# EAGLE design Renesas_Raspi1_Add_On_V2 (EAGLE 9.1.3)
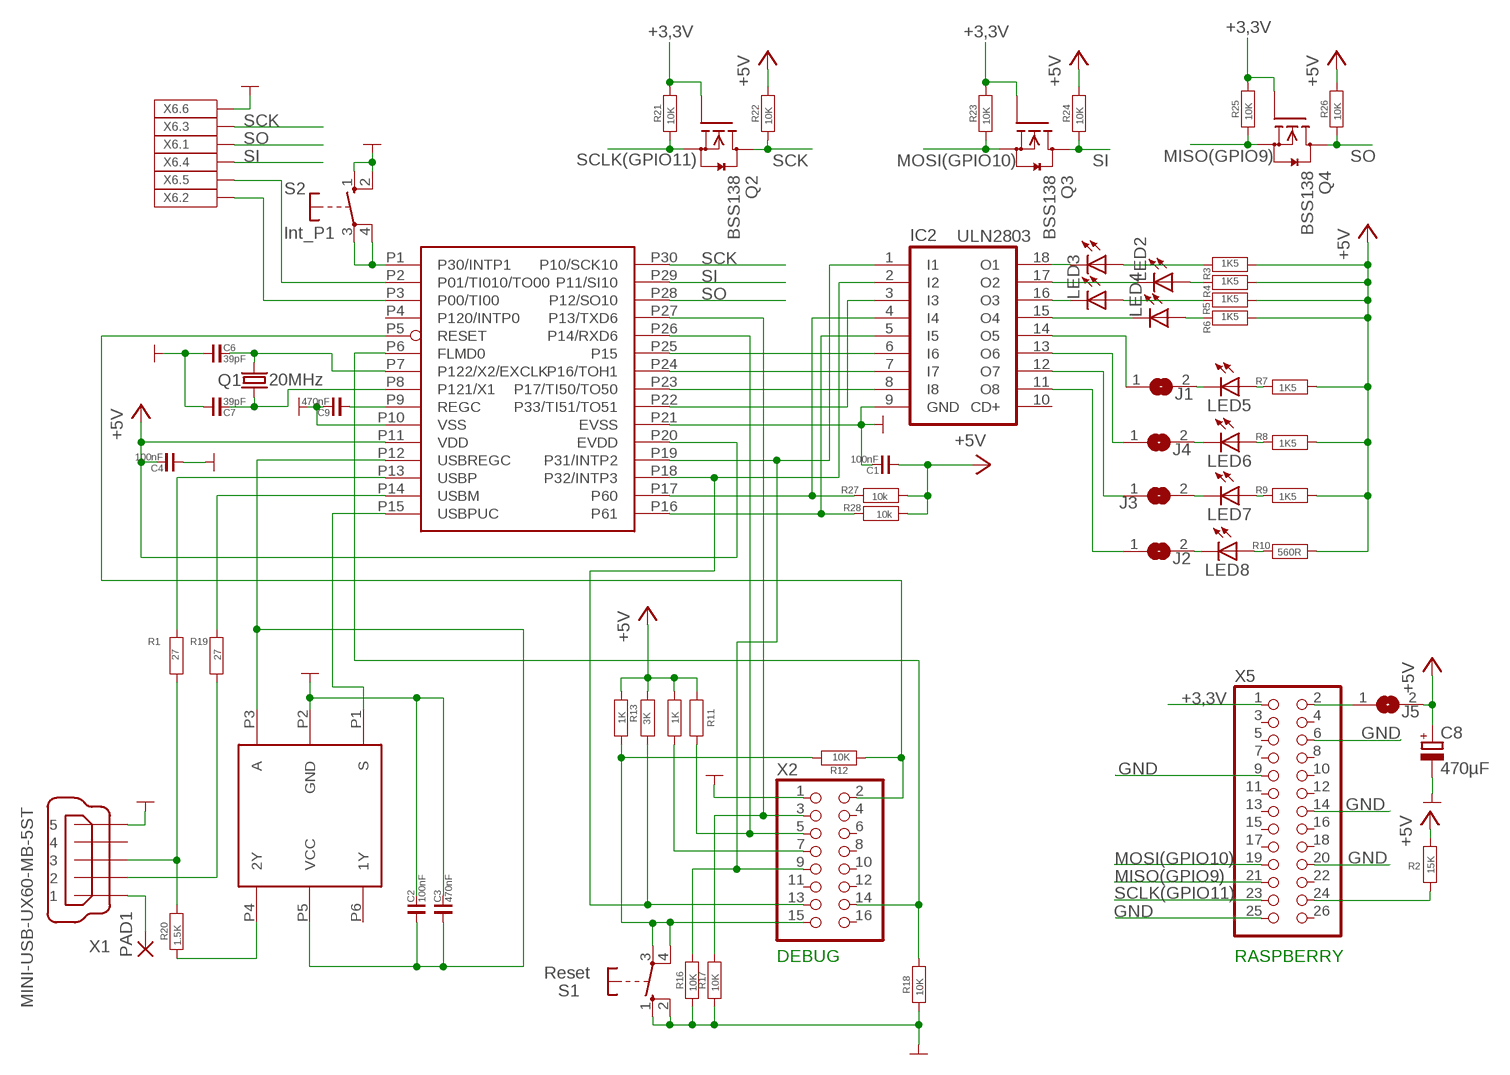
[diagram p0: schematic, sheet 1]

## Parts
C1  100nF  C-0603  [0603]
C2  100nF  C-0603  [0603]
C3  470nF  C-0603  [0603]
C4  100nF  C-0603  [0603]
C6  39pF  C-0603  [0603]
C7  39pF  C-0603  [0603]
C8  470µF  CPOL-EUSANYO_SMD_F8  [SANYO-OSCON_SMD_F8]
C9  470nF  C-0603  [0603]
IC1  78F0730_CAB_AX  [SSOP30]
IC2  ULN2803  [SOJ18-4]
IC3  74LVC1G18  [74LVC1G18]
J1  SJ  [SJ]
J2  SJ  [SJ]
J3  SJ  [SJ]
J4  SJ  [SJ]
J5  SJ  [SJ]
LED1  LEDCHIP-LED0603  [CHIP-LED0603]
LED2  LEDCHIP-LED0603  [CHIP-LED0603]
LED3  LEDCHIP-LED0603  [CHIP-LED0603]
LED4  LEDCHIP-LED0603  [CHIP-LED0603]
LED5  LEDCHIP-LED0603  [CHIP-LED0603]
LED6  LEDCHIP-LED0603  [CHIP-LED0603]
LED7  LEDCHIP-LED0603  [CHIP-LED0603]
LED8  LEDCHIP-LED0603  [CHIP-LED0603]
PAD1  1,6/0,8  [1,6/0,8]
Q1  20MHz  CRYSTALHC49UP  [HC49UP]
Q2  BSS138  [SOT23]
Q3  BSS138  [SOT23]
Q4  BSS138  [SOT23]
R1  27  R-0603  [0603]
R2  15K  R-0603  [0603]
R3  1K5  R-0603  [0603]
R4  1K5  R-0603  [0603]
R5  1K5  R-0603  [0603]
R6  1K5  R-0603  [0603]
R7  1K5  R-0603  [0603]
R8  1K5  R-0603  [0603]
R9  1K5  R-0603  [0603]
R10  560R  R-0603  [0603]
R11  3K  R-0603  [0603]
R12  10K  R-0603  [0603]
R13  3K  R-0603  [0603]
R14  1K  R-0603  [0603]
R15  1K  R-0603  [0603]
R16  10K  R-0603  [0603]
R17  10K  R-0603  [0603]
R18  10K  R-0603  [0603]
R19  27  R-0603  [0603]
R20  1.5K  R-0603  [0603]
R21  10K  R-0603  [0603]
R22  10K  R-0603  [0603]
R23  10K  R-0603  [0603]
R24  10K  R-0603  [0603]
R25  10K  R-0603  [0603]
R26  10K  R-0603  [0603]
R27  10k  R-0603  [0603]
R28  10k  R-0603  [0603]
S1  Reset  DT6  [DT6]
S2  Int_P1  DT6  [DT6]
X1  MINI-USB-UX60-MB-5ST  [UX60-MB-5ST]
X2  PINHD-2X8  [2X08]
X5  PINHD-2X13  [2X13]
X6  2X3  [2X3]

## Nets
+3,3V: Q2.1(G) Q3.1(G) Q4.1(G) R21.1 R23.1 R25.1 X5.1
+5V: C1.1 C4.2 C8.+ IC1.P11(VDD) IC1.P20(EVDD) J5.2 R2.1 R3.2 R4.2 R5.2 R6.2 R7.1 R8.1 R9.1 R10.1 R11.1 R13.2 R14.1 R15.1 R22.1 R24.1 R26.1 R27.1 R28.1
GND: C1.2 C2.2 C3.2 C4.1 C6.1 C7.1 C8.- C9.2 IC1.P10(VSS) IC1.P21(EVSS) IC2.9(GND) IC3.P2(GND) R16.2 R17.2 R18.2 S1.1(S) S1.2(S) S2.1(S) S2.2(S) X1.5 X2.1 X5.6 X5.9 X5.14 X5.20 X5.25 X6.6
MISO(GPIO9): Q4.2(S) R25.2 X5.21
MOSI(GPIO10): Q3.2(S) R23.2 X5.19
N$1: C7.2 IC1.P8(P121/X1) Q1.1
N$2: IC1.P5(RESET) R12.2 X2.2
N$3: IC2.18(O1) LED1.C
N$4: IC2.17(O2) LED2.C
N$5: C6.2 IC1.P7(P122/X2/EXCLK) Q1.2
N$6: IC2.16(O3) LED3.C
N$7: IC1.P22(P33/TI51/TO51) IC2.3(I3)
N$8: IC1.P17(P60) IC2.4(I4) R27.2
N$9: PAD1.1(P) X1.1
N$10: IC1.P19(P31/INTP2) IC2.1(I1) R16.1 X2.9
N$11: IC1.P16(P61) IC2.5(I5) R28.2
N$12: IC1.P25(P15) IC2.6(I6)
N$13: IC1.P24(P16/TOH1) IC2.7(I7)
N$14: R12.1 R15.2 S1.3(P) S1.4(P) X2.15
N$15: IC1.P23(P17/TI50/TO50) IC2.8(I8)
N$16: R2.2 X5.24
N$17: LED1.A R3.1
N$18: IC2.15(O4) LED4.C
N$20: J5.1 X5.2
N$21: R14.2 X2.7
N$23: LED2.A R4.1
N$24: LED3.A R5.1
N$25: IC1.P1(P30/INTP1) S2.3(P) S2.4(P)
N$26: LED4.A R6.1
N$27: LED8.A R10.2
N$30: IC1.P2(P01/TI010/TO00) X6.5
N$31: IC1.P3(P00/TI00) X6.2
N$33: IC2.13(O6) J4.1
N$35: C9.1 IC1.P9(REGC)
N$38: J1.2 LED5.C
N$39: IC2.12(O7) J3.1
N$40: LED7.A R9.2
N$41: IC2.11(O8) J2.1
N$42: LED6.A R8.2
N$43: LED5.A R7.2
N$44: IC1.P6(FLMD0) R18.1 X2.14
N$46: IC1.P18(P32/INTP3) IC2.2(I2) R13.1 X2.13
N$51: IC1.P13(USBP) R1.1
N$52: R1.2 R20.1 X1.3
N$56: R19.2 X1.2
N$57: IC1.P14(USBM) R19.1
N$58: IC1.P15(USBPUC) IC3.P1(S)
N$59: C2.1 C3.1 IC1.P12(USBREGC) IC3.P3(A) IC3.P5(VCC)
N$60: IC3.P4(2Y) R20.2
N$65: J4.2 LED6.C
N$66: J3.2 LED7.C
N$67: J2.2 LED8.C
N$68: IC2.14(O5) J1.1
N$110: IC1.P26(P14/RXD6) R11.2 X2.5
N$113: IC1.P27(P13/TXD6) R17.1 X2.3
SCK: IC1.P30(P10/SCK10) Q2.3(D) R22.2 X6.3
SCLK(GPIO11): Q2.2(S) R21.2 X5.23
SI: IC1.P29(P11/SI10) Q3.3(D) R24.2 X6.4
SO: IC1.P28(P12/SO10) Q4.3(D) R26.2 X6.1
Unconnected: IC1.P4(P120/INTP0) IC2.10(CD+) IC3.P6(1Y) X1.4 X2.4 X2.6 X2.8 X2.10 X2.11 X2.12 X2.16 X5.3 X5.4 X5.5 X5.7 X5.8 X5.10 X5.11 X5.12 X5.13 X5.15 X5.16 X5.17 X5.18 X5.22 X5.26

## Notes on the sheet
- DEBUG | RASPBERRY

## Library data of the parts
C1-C4 C6 C7 C9 = RLC:C-0603
C8 = rcl:CPOL-EU: POLARIZED CAPACITOR, European symbol
IC1 = Renesas_78k0_0_2:78F0730_CAB_AX
IC2 = smd-ipc:ULN2803
IC3 = Hand_Solder_Special:74LVC1G18
J1-J5 = jumper:SJ: SMD solder JUMPER
LED1-LED8 = led:LED: LED OSRAM: - CHIPLED LG R971, LG N971, LY N971, LG Q971, LY Q971, LO R971, LY R971 LH N974, LH R974 LS Q976, LO Q976, LY Q976 LO Q996 - Hyper CHIPLED LW Q18S LB Q993, LB Q99A, LB R99A - SideLED LS A670, LO A670, LY A670, LG A670, LP A670 LB A673, LV A673, LT A673, LW A673 LH A674 LY A675 LS A676, LA A676, LO A676, LY A676, LW A676 LS A679, LY A679, LG A679 - Hyper Micro SIDELED® LS Y876, LA Y876, LO Y876, LY Y876 LT Y87S - SmartLED LW L88C, LW L88S LB L89C, LB L89S, LG L890 LS L89K, LO L89K, LY L89K LS L896, LA L896, LO L896, LY L896 - TOPLED LS T670, LO T670, LY T670, LG T670, LP T670 LSG T670, LSP T670, LSY T670, LOP T670, LYG T670 LG T671, LOG T671, LSG T671 LB T673, LV T673, LT T673, LW T673 LH T674 LS T676, LA T676, LO T676, LY T676, LB T676, LH T676, LSB T676, LW T676 LB T67C, LV T67C, LT T67C, LS T67K, LO T67K, LY T67K, LW E67C LS E67B, LA E67B, LO E67B, LY E67B, LB E67C, LV E67C, LT E67C LW T67C LS T679, LY T679, LG T679 LS T770, LO T770, LY T770, LG T770, LP T770 LB T773, LV T773, LT T773, LW T773 LH T774 LS E675, LA E675, LY E675, LS T675 LS T776, LA T776, LO T776, LY T776, LB T776 LHGB T686 LT T68C, LB T68C - Hyper Mini TOPLED® LB M676 - Mini TOPLED Santana® LG M470 LS M47K, LO M47K, LY M47K Source: http://www.osram.convergy.de LUXEON: - LUMILED® LXK2-PW12-R00, LXK2-PW12-S00, LXK2-PW14-U00, LXK2-PW14-V00 LXK2-PM12-R00, LXK2-PM12-S00, LXK2-PM14-U00 LXK2-PE12-Q00, LXK2-PE12-R00, LXK2-PE12-S00, LXK2-PE14-T00, LXK2-PE14-U00 LXK2-PB12-K00, LXK2-PB12-L00, LXK2-PB12-M00, LXK2-PB14-N00, LXK2-PB14-P00, LXK2-PB14-Q00 LXK2-PR12-L00, LXK2-PR12-M00, LXK2-PR14-Q00, LXK2-PR14-R00 LXK2-PD12-Q00, LXK2-PD12-R00, LXK2-PD12-S00 LXK2-PH12-R00, LXK2-PH12-S00 LXK2-PL12-P00, LXK2-PL12-Q00, LXK2-PL12-R00 Source: www.luxeon.com KINGBRIGHT: KA-3528ASYC Source: www.kingbright.com
PAD1 = wirepad:1,6/0,8: THROUGH-HOLE PAD
Q1 = crystal:CRYSTAL: CRYSTAL
Q2-Q4 = m-pad-2.1:BSS138: Fairchild Semiconductors BSS138 N-Channel Logic Level Enhancement Mode Field Effect Transistor General Description: These N-Channel enhancement mode field effect transistors are produced using Fairchild's proprietary, high cell density, DMOS technology. These products have been designed to minimize on-state resistance while provide rugged, reliable, and fast switching performance.These products are particularly suited for low voltage, low current applications such as small servo motor control, power MOSFET gate drivers, and other switching applications. Features: 0.22 A, 50 V. RDS(ON) = 3.5Ohm @ VGS = 10 V RDS(ON) = 6.0Ohm @ VGS = 4.5 V High density cell design for extremely low RDS(ON) Rugged and Reliable Compact industry standard SOT-23 surface mount package Please send any comments to: messi@users.sourceforge.net
R1-R28 = RLC:R-0603
S1 S2 = switch-misc:DT: ITT SWITCH
X1 = con-hirose:MINI-USB-: MINI USB Connector Source: http://www.hirose.co.jp/cataloge_hp/e24000019.pdf; OC_FARNELL: unknown; OC_NEWARK: unknown
X2 = pinhead_2mm:PINHD-2X8: PIN HEADER
X5 = pinhead2:PINHD-2X13: PIN HEADER
X6 = Connecto:2X3

## Board
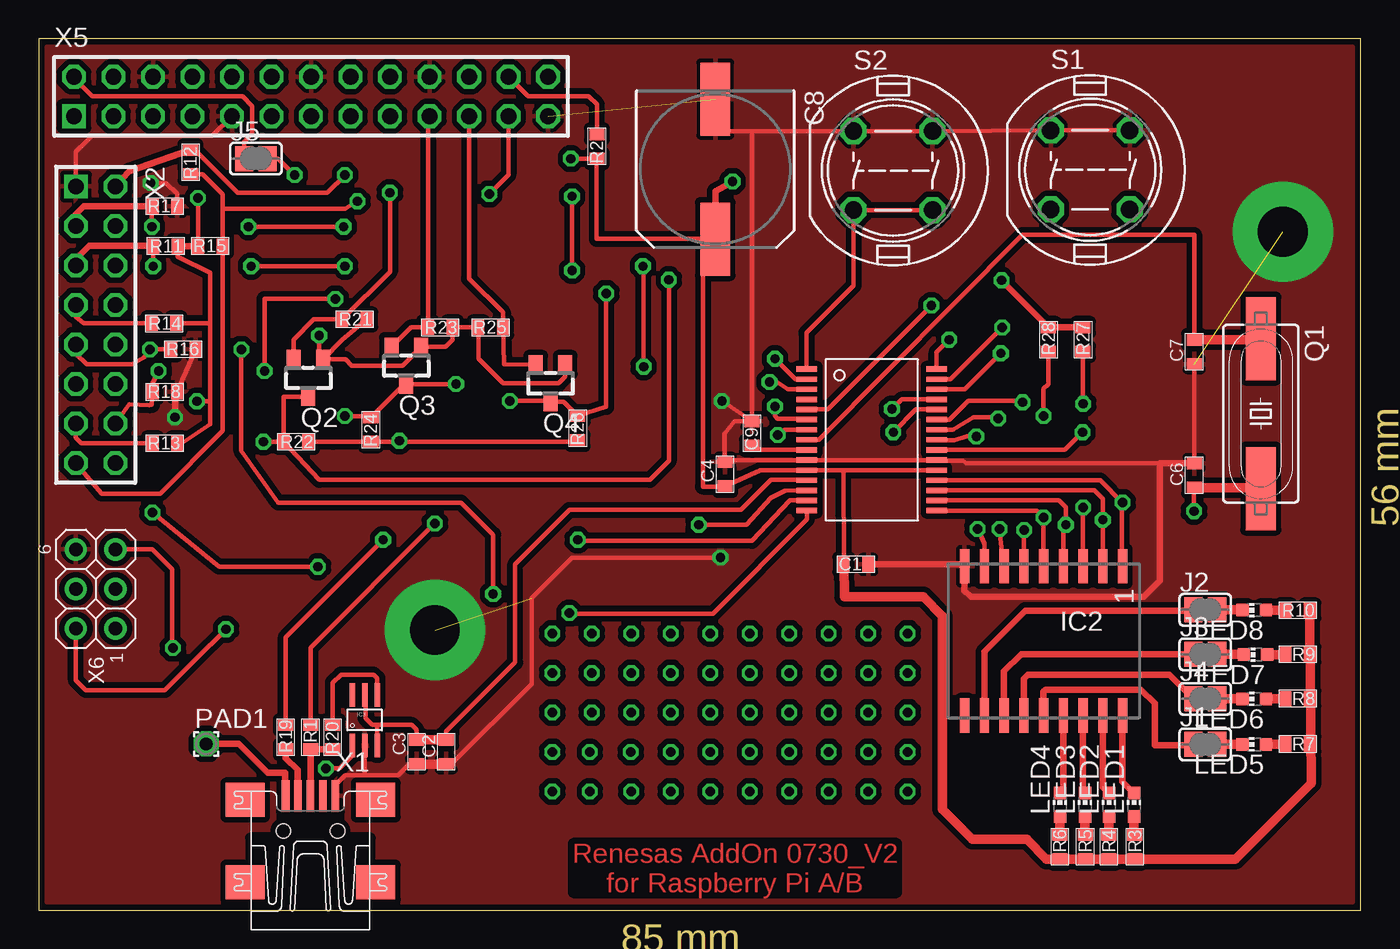
[diagram p1: board, top side]
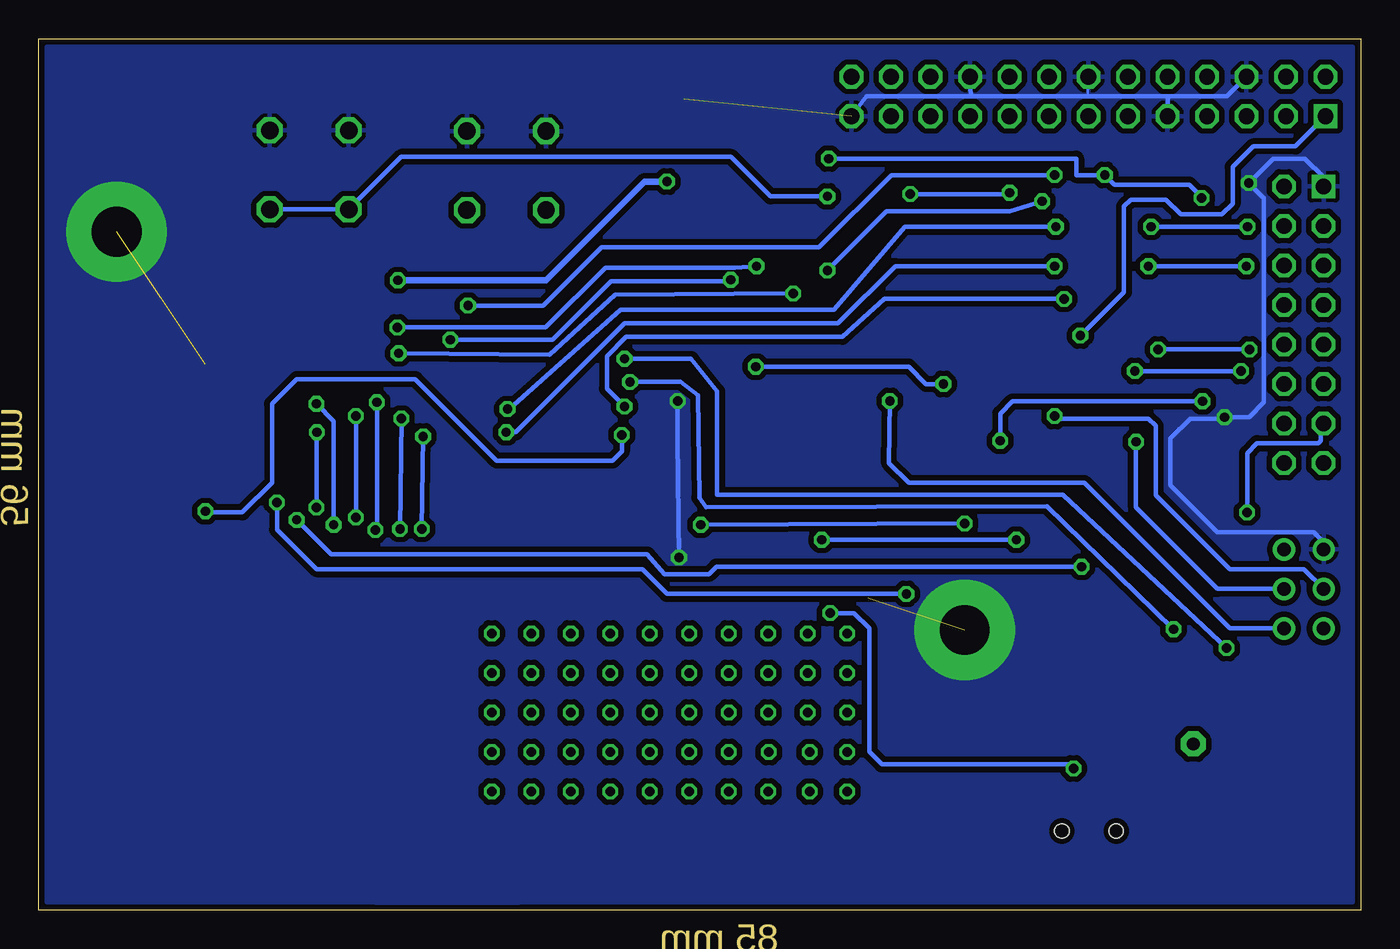
[diagram p2: board, bottom side, seen from below]

Size 85 x 56 mm. Coordinates in mm from the lower left corner, seen from the top.
Outline: 0,0 85,0 85,56 0,56 0,0
Copper layers (1*16): Top 0.035mm / dielectric 1.5mm / Bottom 0.035mm
Design rules "default": minimum track width 1mil, minimum drill 5mil, track to track 4mil, track to pad 4mil, pad to pad 4mil, via to via 4mil, smd to smd 4mil, copper to edge 0mil, drill to drill 1mil, minimum pad ring 10mil, minimum via ring 8mil, stop-mask expansion 4mil, vias tented up to drill 0mil, thermal gap 10mil

### Footprints (pad centres in the part's own frame; a part is rotated, then mirrored left to right if it is on the bottom)
0603 = smd 0.762 x 0.965: 1 -0.787,0; 2 0.787,0
SANYO-OSCON_SMD_F8 = smd 4.7 x 1.9: + 4.5,0; - -4.5,0
SSOP30 = smd 0.34 x 1.32: P1 -4.296,-4.423; P2 -3.646,-4.423; P3 -2.996,-4.423; P4 -2.346,-4.423; P5 -1.696,-4.423; P6 -1.046,-4.423; P7 -0.396,-4.423; P8 0.254,-4.423; P9 0.904,-4.423; P10 1.554,-4.423; P11 2.204,-4.423; P12 2.854,-4.423; P13 3.504,-4.423; P14 4.154,-4.423; P15 4.804,-4.423; P16 4.804,3.915; P17 4.154,3.915; P18 3.504,3.915; P19 2.854,3.915; P20 2.204,3.915; P21 1.554,3.915; P22 0.904,3.915; P23 0.254,3.915; P24 -0.396,3.915; P25 -1.046,3.915; P26 -1.696,3.915; P27 -2.346,3.915; P28 -2.996,3.915; P29 -3.646,3.915; P30 -4.296,3.915
SOJ18-4 = smd 0.6 x 2.2: 1 -5.08,-4.8; 2 -3.81,-4.8; 3 -2.54,-4.8; 4 -1.27,-4.8; 5 0,-4.8; 6 1.27,-4.8; 7 2.54,-4.8; 8 3.81,-4.8; 9 5.08,-4.8; 10 5.08,4.8; 11 3.81,4.8; 12 2.54,4.8; 13 1.27,4.8; 14 0,4.8; 15 -1.27,4.8; 16 -2.54,4.8; 17 -3.81,4.8; 18 -5.08,4.8
74LVC1G18 = smd 0.35 x 1.5: P1 -0.8,-1.65; P2 0,-1.65; P3 0.8,-1.65; P4 0.8,1.6; P5 0,1.6; P6 -0.8,1.6
SJ = smd 1.168 x 1.6: 1 -0.762,0; 2 0.762,0
CHIP-LED0603 = smd 0.8 x 0.8: A 0,-0.75; C 0,0.75
1,6/0,8 = drill 0.813 pad 1.6 octagon: 1 0,0
HC49UP = smd 5.334 x 1.93: 1 -4.826,0; 2 4.826,0
SOT23 = smd 0.9 x 1.2: 1 -0.95,-1.2; 2 0.95,-1.2; 3 0,1.2
DT6 = drill 1.118 octagon: 1 -2.54,2.54; 2 2.54,2.54; 3 2.54,-2.54; 4 -2.54,-2.54
UX60-MB-5ST = smd 2 x 0.5: 1 2.25,1.6; 2 2.25,0.8; 3 2.25,0; 4 2.25,-0.8; 5 2.25,-1.6 | smd 2.2 x 2.5: M1 -3.3,-4.2; M2 -3.3,4.2; M3 2,4.2; M4 2,-4.2 | hole 0.9: 0,-1.75; 0,1.75
2X08 = drill 1.016 square: 1 -8.89,-1.27 | drill 1.016 octagon: 2 -8.89,1.27; 3 -6.35,-1.27; 4 -6.35,1.27; 5 -3.81,-1.27; 6 -3.81,1.27; 7 -1.27,-1.27; 8 -1.27,1.27; 9 1.27,-1.27; 10 1.27,1.27; 11 3.81,-1.27; 12 3.81,1.27; 13 6.35,-1.27; 14 6.35,1.27; 15 8.89,-1.27; 16 8.89,1.27
2X13 = drill 1.016 square: 1 -15.24,-1.27 | drill 1.016 octagon: 2 -15.24,1.27; 3 -12.7,-1.27; 4 -12.7,1.27; 5 -10.16,-1.27; 6 -10.16,1.27; 7 -7.62,-1.27; 8 -7.62,1.27; 9 -5.08,-1.27; 10 -5.08,1.27; 11 -2.54,-1.27; 12 -2.54,1.27; 13 0,-1.27; 14 0,1.27; 15 2.54,-1.27; 16 2.54,1.27; 17 5.08,-1.27; 18 5.08,1.27; 19 7.62,-1.27; 20 7.62,1.27; 21 10.16,-1.27; 22 10.16,1.27; 23 12.7,-1.27; 24 12.7,1.27; 25 15.24,-1.27; 26 15.24,1.27
2X3 = drill 0.889 pad 1.422: 1 0,0; 2 0,2.54; 3 2.54,0; 4 2.54,2.54; 5 5.08,0; 6 5.08,2.54

### Placement (x,y rotation side)
C1  52.55,22.23 0 top
C2  26.19,10.16 270 top
C3  24.29,10.16 270 top
C4  44.12,28.02 270 top
C6  74.3,27.94 270 top
C7  74.3,35.88 90 top
C8  43.5,47.62 270 top
C9  45.86,30.64 90 top
IC1  53.82,30.48 270 top
IC2  64.61,17.3 180 top
IC3  20.95,12.22 0 top
J1  75.01,10.65 0 top
J2  75.01,19.3 0 top
J3  75.01,16.44 0 top
J4  75.01,13.57 0 top
J5  13.96,48.3 0 top
LED1  70.43,6.76 0 top
LED2  68.82,6.76 0 top
LED3  67.27,6.76 0 top
LED4  65.66,6.76 0 top
LED5  78.15,10.65 90 top
LED6  78.15,13.56 90 top
LED7  78.24,16.41 90 top
LED8  78.15,19.27 90 top
PAD1  10.76,10.68 0 top
Q1  78.58,31.91 270 top
Q2  17.32,34.21 180 top
Q3  23.62,35 180 top
Q4  32.9,33.86 180 top
R1  17.46,11.11 270 top
R2  35.89,49.09 90 top
R3  70.49,4.06 270 top
R4  68.81,4.06 270 top
R5  67.29,4.06 270 top
R6  65.65,4.06 270 top
R7  80.95,10.67 180 top
R8  80.95,13.59 180 top
R9  80.95,16.43 180 top
R10  80.95,19.27 180 top
R11  8.14,42.68 180 top
R12  9.76,48.08 90 top
R13  8.1,30 0 top
R14  8.05,37.71 180 top
R15  11.02,42.68 0 top
R16  9.29,36.05 0 top
R17  8.1,45.24 0 top
R18  8.1,33.31 0 top
R19  15.88,11.11 270 top
R20  18.89,11.11 90 top
R21  20.3,37.98 180 top
R22  16.54,30.1 180 top
R23  25.81,37.45 180 top
R24  21.35,30.89 90 top
R25  29.05,37.45 0 top
R26  34.65,30.98 90 top
R27  67.15,36.67 270 top
R28  64.93,36.67 270 top
S1  67.61,47.58 0 top
S2  54.93,47.54 0 top
X1  17.46,5.08 90 top
X2  3.65,37.62 270 top
X5  17.5,52.3 0 top
X6  4.92,18.1 90 top

### Tracks (layer width: path | path; a pad name or v marks a point on that pad's centre or on a via)
+3,3V  (via drill 0.6)
  Top 0.305: R21.1 19.51,36.65 Q2.1 | Q2.1 19.71,35.41 20.12,35 23.38,35 Q3.1 24.6,36.23 26.16,36.23 26.6,36.66 R23.1 R25.1 28.26,35.44 29.84,33.86 33.42,33.86 33.85,34.29 Q4.1 | v18.02,36.92 18.02,35.66 Q2.1
  Bottom 0.305: X5.1 4.2,49.09 6.91,49.09 8.22,47.77 8.22,45.41 8.93,44.71 11.55,44.71 12.51,45.67 14.79,45.67 15.22,45.24 15.22,39.73 v18.02,36.92
+5V  (via drill 0.6)
  Top 0.305: 51.75,28.28 IC1.P11 46.4,28.28 C4.2 44.12,27.21 42.7,27.21 42.7,43.12 C8.+ 43.5,43.14 35.88,43.14 35.88,48.3 R2.1 v34.21,48.3 | 51.75,28.28 51.76,28.28 IC1.P20 | 64.8,3.27 R6.2 | 68.86,3.27 R5.2 | R11.1 8.93,41.99 11.03,40.95 11.03,37.71 R14.1 11.03,37.71 11.03,32.86 11.03,32.7 | R13.2 9.18,30 11.03,31.24 11.03,32.7 | R15.1 v10.23,45.76 v10.24,45.76 | R22.1 18.9,30.1 R24.1 23.11,30.1 v23.18,30.16 23.24,30.1 34.65,30.1 R26.1 | J5.2 15.4,48.3 v16.45,47.25 | v10.16,32.7 11.03,32.7 | C1.1 51.75,28.28
  Top 0.406: R10.1 81.74,16.35 R9.1 81.74,13.33 R8.1 R7.1 | R11.1 R15.1 | R27.1 R28.1 v61.91,40.48 | v44.61,46.83 43.5,46.2 C8.+
  Top 0.61: R3.2 R4.2 | R4.2 68.86,3.27 | R4.2 64.8,3.27 63.52,4.55 60.02,4.55 58.1,6.47 58.1,18.9 56.88,20.12 51.8,20.12 | R4.2 76.95,3.27 81.81,8.14 81.72,18.38 R10.1 | 51.8,20.12 | 51.8,20.12 C1.1
  Bottom 0.305: v10.24,45.76 10.24,45.85 11.03,46.64 15.84,46.64 v16.45,47.25 18.29,47.25 18.29,48.3 v34.21,48.3 | v23.18,30.16 23.18,31.91 22.38,32.7 v10.16,32.7
  Bottom 0.406: v61.91,40.48 52.39,40.48 46.04,46.83 v44.61,46.83
GND  (via drill 0.6, 3.2 pad 6.45)  (3 unrouted)
  Top 0.254: 26.2,9.43 26.19,9.41 | 26.25,9.36 26.2,9.36
  Top 0.305: C9.2 44.73,31.43 44.1,30.62 44.1,28.83 C4.1 44.25,28.93 IC1.P10 IC1.P21 57.77,28.88 59.41,28.88 59.65,28.73 72.1,28.73 | 26.25,9.36 26.2,9.41 26.2,9.43 26.57,9.43 31.68,14.53 31.68,20.04 34.29,22.65 v43.84,22.65 | 26.2,9.36 C2.2 | C7.1 C6.1 | C9.2 45.86,50.05 43.58,50.05 43.58,52.12 C8.- 43.92,51.7 43.92,50.31 44.16,50.08 S2.1 S2.2 S1.1 S1.2 | v43.92,32.73 45.87,31.41 C9.2 | C3.2 23.81,9.37 23.1,8.66 21,8.66 | 21,8.66 19.69,8.66 18.99,7.96 18.99,7.41 X1.5 | IC3.P2 20.95,8.71 21,8.66 | v7.19,46.73 8.2,46.73 8.89,46.04 R17.2 | R18.2 R16.2 | X5.9 11.16,49.77 3.41,49.77 3.02,49.37 2.38,48.74 X2.1
  Top 0.406: C1.2 59.53,22.23 IC2.9 59.53,20.53 59.94,20.12 71.05,20.12 72.1,21.18 72.1,28.73 C6.1 | v8.75,31.68 8.75,33.52 R18.2
  Top 0.61: C3.2 C2.2
  Bottom 0.152: 17.54,52.31 X5.14
  Bottom 0.305: v43.84,22.65 43.92,30.27 v43.92,32.73 | X2.1 2.38,47.09 3.59,48.3 5.62,48.3 v7.19,46.73 | v7.19,46.73 7.09,46.81 | X6.6 2.38,23.65 3.02,24.29 9.21,24.29 12.22,27.3 12.22,30.32 10.95,31.59 8.83,31.59 v8.75,31.68 7.17,31.68 6.21,32.64 6.21,45.78 6.25,45.78 v7.19,46.73 | X5.6 8.62,52.31 12.38,52.31 | 25.08,52.31 17.54,52.31 12.38,52.31 | 25.08,52.31 25.15,52.31 | 12.38,52.31 X5.9 | X5.20 25.08,52.31 | 25.08,52.31 31.77,52.31 X5.25
  other vias: 80,43.6 25.47,17.99
  pour Bottom (isolate 0.356): 0.5,55.5 0.5,0.5 54.13,0.48 63.34,0.48 63.18,0.5 84.5,0.5 84.5,55.5
  pour Top (isolate 0.356): 0.5,55.5 0.5,0.5 84.5,0.5 84.5,55.5
MISO(GPIO9)
  Top 0.305: R25.2 29.93,35.08 Q4.2 | X5.21 27.66,40.59 29.84,38.41 R25.2 | R25.2
MOSI(GPIO10)
  Top 0.305: Q3.2 23.93,37.45 R23.2 25.02,51.03 X5.19
N$1
  Top 0.305: IC1.P8 50.18,30.23 63.26,43.4 74.29,43.4 C7.2
  Top 0.61: C7.2 78.51,36.66 Q1.1
N$2  (via drill 0.6)
  Top 0.305: IC1.P5 49.42,32.2 50.75,32.2 v57.4,38.85 | R12.2 10.02,48.86 12.78,46.11 18.55,46.11 v19.69,47.25
  Top 0.406: X2.2 5.82,47.48 R12.2
  Bottom 0.305: v19.69,47.25 30.19,47.25 34.83,42.61 48.83,42.61 52.59,38.85 v57.4,38.85
N$3
  Top 0.406: IC2.18 69.69,8.24 LED1.C
N$4
  Top 0.406: IC2.17 68.42,7.9 LED2.C
N$5  (via drill 0.6)
  Top 0.305: IC1.P7 47.94,30.88 v47.51,30.54 | v74.29,25.64 74.29,27.14 C6.2
  Top 0.61: C6.2 78.51,27.15 Q1.2
  Bottom 0.305: v47.51,30.54 47.51,29.48 48.1,28.89 55.56,28.89 60.8,34.13 68.42,34.13 70.01,32.54 70.01,27.46 71.91,25.56 74.21,25.56 v74.29,25.64
N$6
  Top 0.406: IC2.16 67.15,7.63 LED3.C
N$7  (via drill 0.6)
  Top 0.305: IC1.P22 65.98,29.58 v67.11,30.71 | IC2.3 v67.15,25.88
  Bottom 0.305: v67.15,25.88 67.15,30.67 v67.11,30.71
N$8  (via drill 0.6)
  Top 0.305: IC2.4 65.89,24.61 v66.04,24.77 66.04,25.88 65.59,26.33 IC1.P17 | v67.15,32.54 R27.2
  Bottom 0.305: v66.04,24.77 66.04,31.43 v67.15,32.54
N$9
  Top 0.406: PAD1.1 12.86,10.68 14.7,8.84 15.84,8.84 15.84,7.36 X1.1
N$10  (via drill 0.6)
  Top 0.305: IC2.1 69.65,22.14 69.65,26.15 v69.69,26.19 68.26,27.63 IC1.P19 | X2.9 2.38,35.77 3.06,35.09 5.99,35.09 6.77,35.53 7.06,36.04 v7.14,36.04 v7.14,36.05 R16.1 | v29.21,20.32 29.21,24.13 27.15,26.19 15.4,26.19 13.02,29.53 v13.02,36.04
  Bottom 0.305: v69.69,26.19 69.69,24.45 67.15,21.91 46.2,21.91 44.61,20.32 v29.21,20.32 | v13.02,36.04 v7.14,36.04
N$11  (via drill 0.6)
  Top 0.305: IC2.5 64.58,22.14 64.61,22.14 v64.61,25.24 64.18,25.68 IC1.P16 | v64.61,31.75 64.61,33.5 64.93,33.81 R28.2
  Bottom 0.305: v64.61,25.24 v64.61,31.75
N$12  (via drill 0.6)
  Top 0.305: IC1.P25 58.56,31.53 59.76,32.73 63.17,32.73 v63.26,32.64 | v63.35,24.43 63.35,22.11 IC2.6
  Bottom 0.305: v63.26,32.64 63.26,24.68 v63.35,24.43
N$13  (via drill 0.6)
  Top 0.305: IC1.P24 58.79,30.88 60.11,31.68 61.6,31.68 v61.69,31.59 | v61.77,24.5 62.04,22.14 IC2.7
  Bottom 0.305: v61.69,31.59 v61.77,24.5
N$14  (via drill 0.6 pad 1)
  Top 0.305: R12.1 10.55,47.29 11.81,46.02 11.81,45.09 | 11.81,45.09 R15.2 11.81,30.8 7.79,26.77 4.03,26.77 X2.15 | 11.81,45.09 | 11.81,45.09 19.68,45.09 v20.48,45.56 | v34.29,45.88 v34.29,41.12
  Bottom 0.305: v20.48,45.56 22.54,44.93 30.48,44.93 v34.29,41.12 | v34.29,45.88 37.94,45.88 40.48,48.42 61.7,48.42 S1.4 S1.3
N$15  (via drill 0.6)
  Top 0.305: IC2.8 60.8,23.55 v60.38,24.5 | v60.29,30.45 59.67,30.45 58.89,30.19 57.77,30.19 IC1.P23
  Bottom 0.305: v60.38,24.5 v60.29,30.45
N$16
  Top 0.305: R2.2 35.89,51.79 35.35,52.33 31.45,52.33 X5.24
N$17
  Top 0.61: LED1.A 70.43,4.9 R3.1
N$18
  Top 0.406: IC2.15 65.88,7.73 LED4.C
N$20
  Top 0.152: 2.26,53.46 X5.2
  Top 0.305: J5.1 13.2,49.39 13.73,49.92 13.73,51.68 13.1,52.31 3.42,52.31 2.26,53.46
N$21
  Top 0.305: X2.7 2.38,38.13 2.89,37.71 7.08,37.71 R14.2
N$23
  Top 0.61: LED2.A R4.1
N$24
  Top 0.61: LED3.A 67.27,4.86 R5.1
N$25
  Top 0.305: S2.3 S2.4 52.39,40.14 49.35,37.1 49.35,34.82 IC1.P1
N$26
  Top 0.61: LED4.A 65.66,4.86 R6.1
N$27
  Top 0.61: LED8.A R10.2
N$30  (via drill 0.6)
  Top 0.305: IC1.P2 48.65,34.13 v47.34,35.44 | v8.62,16.84 8.57,16.88 8.57,21.91 7.62,22.86 7.29,23.19 X6.5
  Bottom 0.305: v47.34,35.44 43.05,35.44 41.39,33.34 41.39,26.69 19.14,26.69 v8.62,16.84
N$31  (via drill 0.6)
  Top 0.305: IC1.P3 48.16,33.48 47.42,33.95 v46.99,33.95 | v12.04,18.05 9.97,16.01 8.1,14.13 3.02,14.13 2.38,14.76 X6.2
  Bottom 0.305: v46.99,33.95 43.75,33.95 42.61,33.08 42.52,26.51 42.09,25.9 20.17,25.95 14.41,20.35 v12.04,18.05
N$32  (via drill 0.6)
  other vias: 35.44,10.15
N$33
  Top 0.406: IC2.13 63.34,14.87 63.61,15.14 72.68,15.14 J4.1
N$34  (via drill 0.6)
  other vias: 38.06,10.15
N$35
  Top 0.305: IC1.P9 45.87,29.58 C9.1
N$36  (via drill 0.6)
  other vias: 35.44,7.61
N$38
  Top 0.61: J1.2 LED5.C
N$39
  Top 0.406: IC2.12 62.07,15.35 63.17,16.45 74.23,16.45 J3.1
N$40
  Top 0.61: LED7.A 80.14,16.41 R9.2
N$41
  Top 0.406: IC2.11 60.8,16.61 63.44,19.25 74.19,19.25 J2.1
N$42
  Top 0.61: LED6.A 80.14,13.56 R8.2
N$43
  Top 0.61: LED5.A 80.14,10.65 R7.2
N$44  (via drill 0.6)
  Top 0.305: X2.14 5.81,32.5 7.09,32.46 7.26,32.48 R18.1 7.31,33.91 v7.7,34.65 | v14.52,34.65 14.52,39.29 v19.07,39.29 | v47.34,32.38 47.34,31.76 47.51,31.59 49.33,31.59 IC1.P6
  Bottom 0.305: v7.7,34.65 v14.52,34.65 | v19.07,39.29 30.62,39.29 33.34,36.84 47.25,36.84 48.48,35.61 48.48,33.51 v47.34,32.38
N$46  (via drill 0.6)
  Top 0.305: IC1.P18 67.87,26.98 68.42,26.43 v68.42,25.09 v68.42,25.08 IC2.2 | X2.13 2.38,30.34 2.71,30.01 7.3,30.01 R13.1 | v17.94,22.07 11.59,22.07 v7.3,25.56
  Bottom 0.305: v68.42,25.08 66.2,22.86 45.88,22.86 44.77,21.59 41.91,21.59 41.43,22.07 v17.94,22.07 | v7.3,25.56 7.3,29.38 6.67,30.01 2.71,30.01 2.55,30.17 2.55,31.1 X2.13
N$51  (via drill 0.6)
  Top 0.305: R1.1 17.46,16.85 v25.46,24.85 | v42.44,24.76 45.5,24.76 47.08,26.51 47.97,26.95 IC1.P13
  Bottom 0.305: v25.46,24.85 v42.44,24.76
N$52
  Top 0.406: R20.1 R1.2 X1.3
N$56
  Top 0.406: R19.2 15.88,9.76 16.62,9.01 16.62,7.37 X1.2
N$57  (via drill 0.6)
  Top 0.305: R19.1 15.88,17.54 v22.14,23.8 | IC1.P14 48.29,26.33 45.85,23.73 34.74,23.73 v34.65,23.8
  Bottom 0.305: v34.65,23.8 v22.14,23.8
N$58  (via drill 0.6)
  Top 0.305: v18.46,9.1 19.34,9.1 20.21,9.97 20.21,10.52 IC3.P1 | IC1.P15 49.39,25.11 43.34,19.05 34.15,19.05 v34.12,19.09
  Bottom 0.305: v34.12,19.09 32.58,19.09 31.59,18.1 31.59,10.16 30.8,9.37 18.73,9.37 v18.46,9.1
N$59
  Top 0.305: C2.1 26.19,11.49 30.62,15.93 30.62,22.23 34.12,25.73 45.15,25.73 47.08,27.65 49.37,27.65 IC1.P12 | C3.1 24.29,11.59 23.98,11.9 21.79,11.9 | 21.79,11.9 21.44,11.9 21,12.34 21,13.78 IC3.P5 | IC3.P3 21.75,11.87 21.79,11.9
  Top 0.61: C3.1 C2.1
N$60
  Top 0.305: IC3.P4 21.75,14.91 21.52,15.14 19.43,15.14 18.9,14.61 R20.2
N$65
  Top 0.61: J4.2 77.39,13.57 LED6.C
N$66
  Top 0.61: J3.2 77.46,16.44 LED7.C
N$67
  Top 0.61: J2.2 77.37,19.3 LED8.C
N$68
  Top 0.406: IC2.14 64.61,14.04 64.75,14.18 70.88,14.18 71.75,13.3 71.75,10.59 74.19,10.59 J1.1
N$110  (via drill 0.6)
  Top 0.305: IC1.P26 56.41,32.18 v54.95,30.71 | v19.69,41.39 v13.65,41.39 | v7.35,41.39 R11.2
  Top 0.406: X2.5 2.38,41.84 3.24,42.7 7.33,42.7 R11.2
  Bottom 0.305: v54.95,30.71 54.34,30.71 47.34,37.71 33.6,37.71 29.93,41.39 v19.69,41.39 | v13.65,41.39 v7.35,41.39
N$113  (via drill 0.6)
  Top 0.305: IC1.P27 55.49,32.83 v54.86,32.2 | v19.6,43.92 v13.47,43.92 | v7.26,43.92 7.26,45.2 R17.1
  Top 0.406: X2.3 2.38,44.73 2.89,45.24 R17.1
  Bottom 0.305: v54.86,32.2 54.77,32.2 47.6,38.59 33.86,38.59 29.31,43.92 v19.6,43.92 | v13.47,43.92 v7.26,43.92
N$148  (via drill 0.6)
  other vias: 33.02,17.78
N$149  (via drill 0.6)
  other vias: 35.56,17.78
N$150  (via drill 0.6)
  other vias: 38.1,17.78
N$151  (via drill 0.6)
  other vias: 40.64,17.78
N$152  (via drill 0.6)
  other vias: 43.18,17.78
N$153  (via drill 0.6)
  other vias: 45.72,17.78
N$154  (via drill 0.6)
  other vias: 48.26,17.78
N$155  (via drill 0.6)
  other vias: 50.8,17.78
N$156  (via drill 0.6)
  other vias: 53.34,17.78
N$157  (via drill 0.6)
  other vias: 33.02,15.24
N$158  (via drill 0.6)
  other vias: 35.56,15.24
N$159  (via drill 0.6)
  other vias: 38.1,15.24
N$160  (via drill 0.6)
  other vias: 40.64,15.24
N$161  (via drill 0.6)
  other vias: 43.18,15.24
N$162  (via drill 0.6)
  other vias: 45.72,15.24
N$163  (via drill 0.6)
  other vias: 48.26,15.24
N$164  (via drill 0.6)
  other vias: 50.8,15.24
N$165  (via drill 0.6)
  other vias: 53.34,15.24
N$166  (via drill 0.6)
  other vias: 33.02,12.7
N$167  (via drill 0.6)
  other vias: 35.56,12.7
N$168  (via drill 0.6)
  other vias: 38.1,12.7
N$169  (via drill 0.6)
  other vias: 40.64,12.7
N$170  (via drill 0.6)
  other vias: 43.18,12.7
N$171  (via drill 0.6)
  other vias: 45.72,12.7
N$172  (via drill 0.6)
  other vias: 48.26,12.7
N$173  (via drill 0.6)
  other vias: 50.8,12.7
N$174  (via drill 0.6)
  other vias: 53.34,12.7
N$175  (via drill 0.6)
  other vias: 33.02,10.16
N$178  (via drill 0.6)
  other vias: 40.64,10.16
N$179  (via drill 0.6)
  other vias: 43.18,10.16
N$180  (via drill 0.6)
  other vias: 45.72,10.16
N$181  (via drill 0.6)
  other vias: 48.26,10.16
N$182  (via drill 0.6)
  other vias: 50.8,10.16
N$183  (via drill 0.6)
  other vias: 53.34,10.16
N$184  (via drill 0.6)
  other vias: 33.02,7.62
N$186  (via drill 0.6)
  other vias: 38.1,7.62
N$187  (via drill 0.6)
  other vias: 40.64,7.62
N$188  (via drill 0.6)
  other vias: 43.18,7.62
N$189  (via drill 0.6)
  other vias: 45.72,7.62
N$190  (via drill 0.6)
  other vias: 48.26,7.62
N$191  (via drill 0.6)
  other vias: 50.8,7.62
N$192  (via drill 0.6)
  other vias: 53.34,7.62
N$219  (via drill 0.6)
  other vias: 55.88,17.78
N$220  (via drill 0.6)
  other vias: 55.88,15.24
N$221  (via drill 0.6)
  other vias: 55.88,12.7
N$222  (via drill 0.6)
  other vias: 55.88,10.16
N$223  (via drill 0.6)
  other vias: 55.88,7.62
SCK  (via drill 0.6)
  Top 0.305: IC1.P30 57.73,35.86 v58.54,36.66 | v40.51,40.51 40.51,28.88 39.29,27.65 18.02,27.65 R22.2 | Q2.3 17.24,33.01 17.24,32.99 15.75,32.99 R22.2 | v14.45,30.1 R22.2
  Bottom 0.305: v58.54,36.66 51.98,36.66 48.21,40.42 40.6,40.42 v40.51,40.51 | X6.3 9.21,20.64 14.45,25.88 v14.45,30.1
SCLK(GPIO11)  (via drill 0.6)
  Top 0.305: Q2.2 16.38,36.67 17.68,37.98 R21.2 22.57,41.04 v22.57,46.11 | X5.23 30.2,47.26 v28.96,46.02
  Bottom 0.305: v28.96,46.02 22.66,46.02 v22.57,46.11
SI  (via drill 0.6)
  Top 0.305: IC1.P29 58.63,34.13 v61.95,37.45 | v26.83,33.81 26.82,33.8 Q3.3 23.48,33.8 R24.2 21.27,31.75 v19.68,31.75 | v38.89,34.92 38.89,41.34 v38.85,41.39
  Bottom 0.305: v61.95,37.45 52.41,37.45 48.56,41.3 40.25,41.3 v38.85,41.39 | v26.83,33.81 27.94,33.81 29.05,34.92 v38.89,34.92 | X6.4 3.65,21.91 8.41,21.91 13.18,26.67 13.18,31.11 13.65,31.59 19.53,31.59 v19.68,31.75
SO  (via drill 0.6)
  Top 0.305: IC1.P28 59.55,33.48 v61.86,35.79 | v36.49,39.64 36.49,32.34 R26.2 33.75,32.66 Q4.3 32.84,32.73 v30.27,32.73
  Bottom 0.305: v61.86,35.79 52.15,35.7 47.95,39.55 v36.49,39.64 | X6.1 8.41,18.1 17.78,27.46 29.05,27.46 30.32,28.73 v30.27,32.73

### Text on the board
Top: Renesas AddOn 0730_V2 / for Raspberry Pi A/B
Dimension: 56 mm | 85 mm